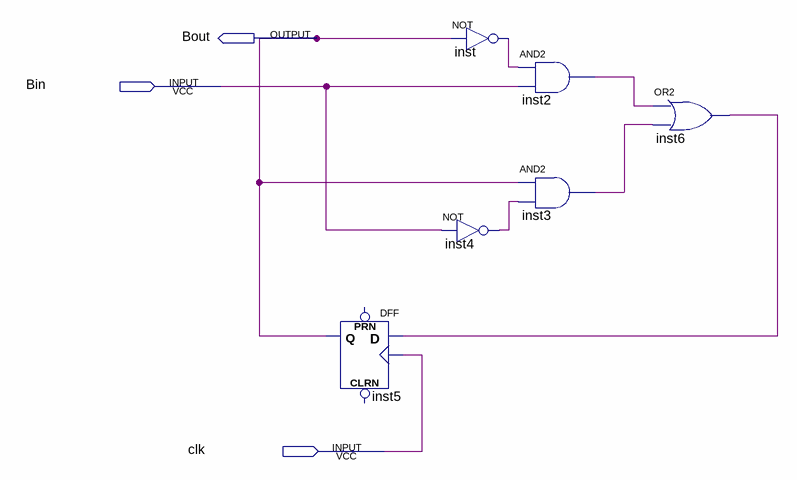
[diagram p0: schematic sheet]
// Quartus schematic setButton.bdf as structural Verilog: 6 symbols, 3 pins
module setButton (
  input  Bin,
  input  clk,
  output Bout
);

  wire inst2_out, inst3_out, inst4_out, inst6_out, inst_out;

  DFF inst5 (.CLK(clk), .D(inst6_out), .Q(Bout));  // open: CLRN, PRN
  not inst (inst_out, Bout);
  not inst4 (inst4_out, Bin);
  and inst2 (inst2_out, inst_out, Bin);
  and inst3 (inst3_out, Bout, inst4_out);
  or inst6 (inst6_out, inst2_out, inst3_out);
endmodule
